# Altium schematic sheet Power.SchDoc
size 292 x 193 mm; Author: Power Lin; DocumentNumber: 1; SheetNumber: 2; SheetTotal: 4; Website: wiki-power.com
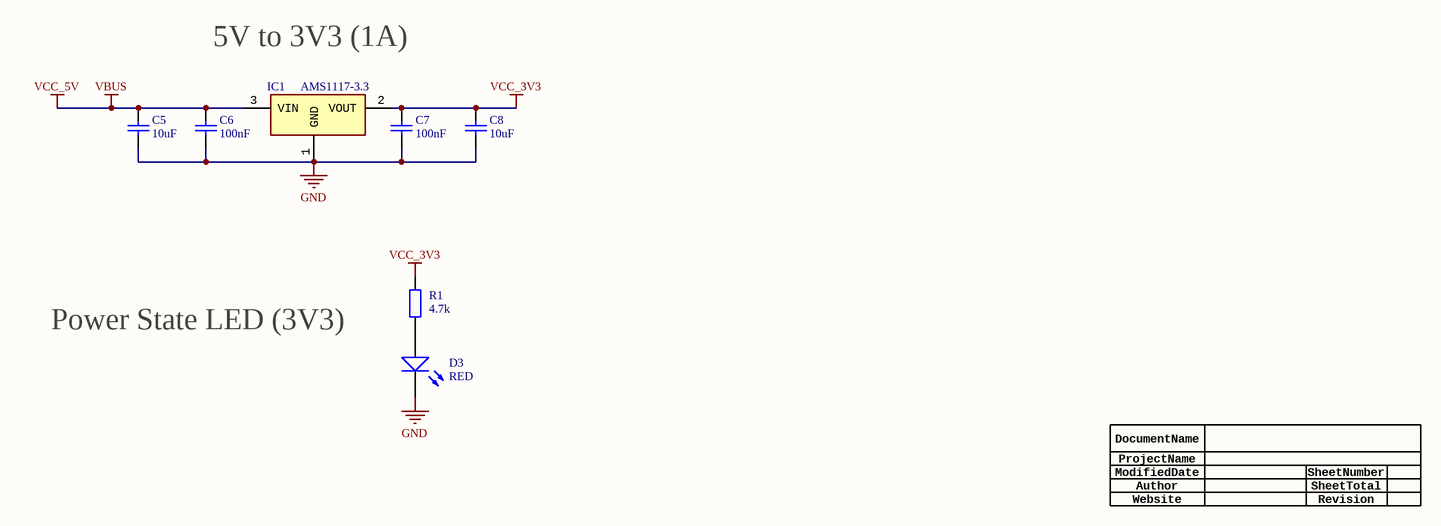
[diagram p0: Power.SchDoc]

## Parts
C5  10uF  [CAP-0603]
C6  100nF  [CAP-0603]
C7  100nF  [CAP-0603]
C8  10uF  [CAP-0603]
D3  RED  [LED-0603]
IC1  AMS1117-3.3  [SOT-223]
R1  4.7k  [R-0603]

## Nets
GND: C5.1 C6.1 C7.1 C8.1 D3.K IC1.1(GND)
VBUS: C5.2 C6.2 IC1.3(VIN)  [also labelled VCC_5V]
VCC_3V3: C7.2 C8.2 IC1.2(VOUT) R1.2
NetD3_A: D3.A R1.1

## Notes on the sheet
- 5V to 3V3 (1A)
- Power State LED (3V3)
- Author
- DocumentName
- ModifiedDate
- ProjectName
- SheetNumber
- SheetTotal
- Website
- Revision

## Library data of the parts
C5-C8 = CAP: 贴片电容; ComponentLink1Description: 供应商链接; ComponentLink1URL: http://www.szlcsc.com/product/details_53938.html; Package: 0402; Supplier: LC; SuppliersPartNumber: C52923
D3 = LED: 发光二极管; pin to pad: A>1 K>2; ComponentLink1Description: 供应商链接; ComponentLink1URL: http://www.szlcsc.com/product/details_2663.html; Package: 0603; Supplier: LC; SuppliersPartNumber: C2290
IC1 = AMS1117: AMS1117-3.3 1.0A; Manufacturer_Name: Nexperia; Manufacturer_Part_Number: SI2302DS; Datasheet Link: https://assets.nexperia.com/documents/data-sheet/SI2302DS.pdf; Height: 1.1mm; Mouser Part Number: N/A; Mouser Price/Stock: https://www.mouser.com/Search/Refine.aspx?Keyword=N%2FA; RS Part Number: 7983053P; RS Price/Stock: http://uk.rs-online.com/web/p/products/7983053P
R1 = RES: 贴片电阻; Package: 0805; Supplier: LC; SuppliersPartNumber: C17798